# EAGLE design Schematic (EAGLE 9.4.2)
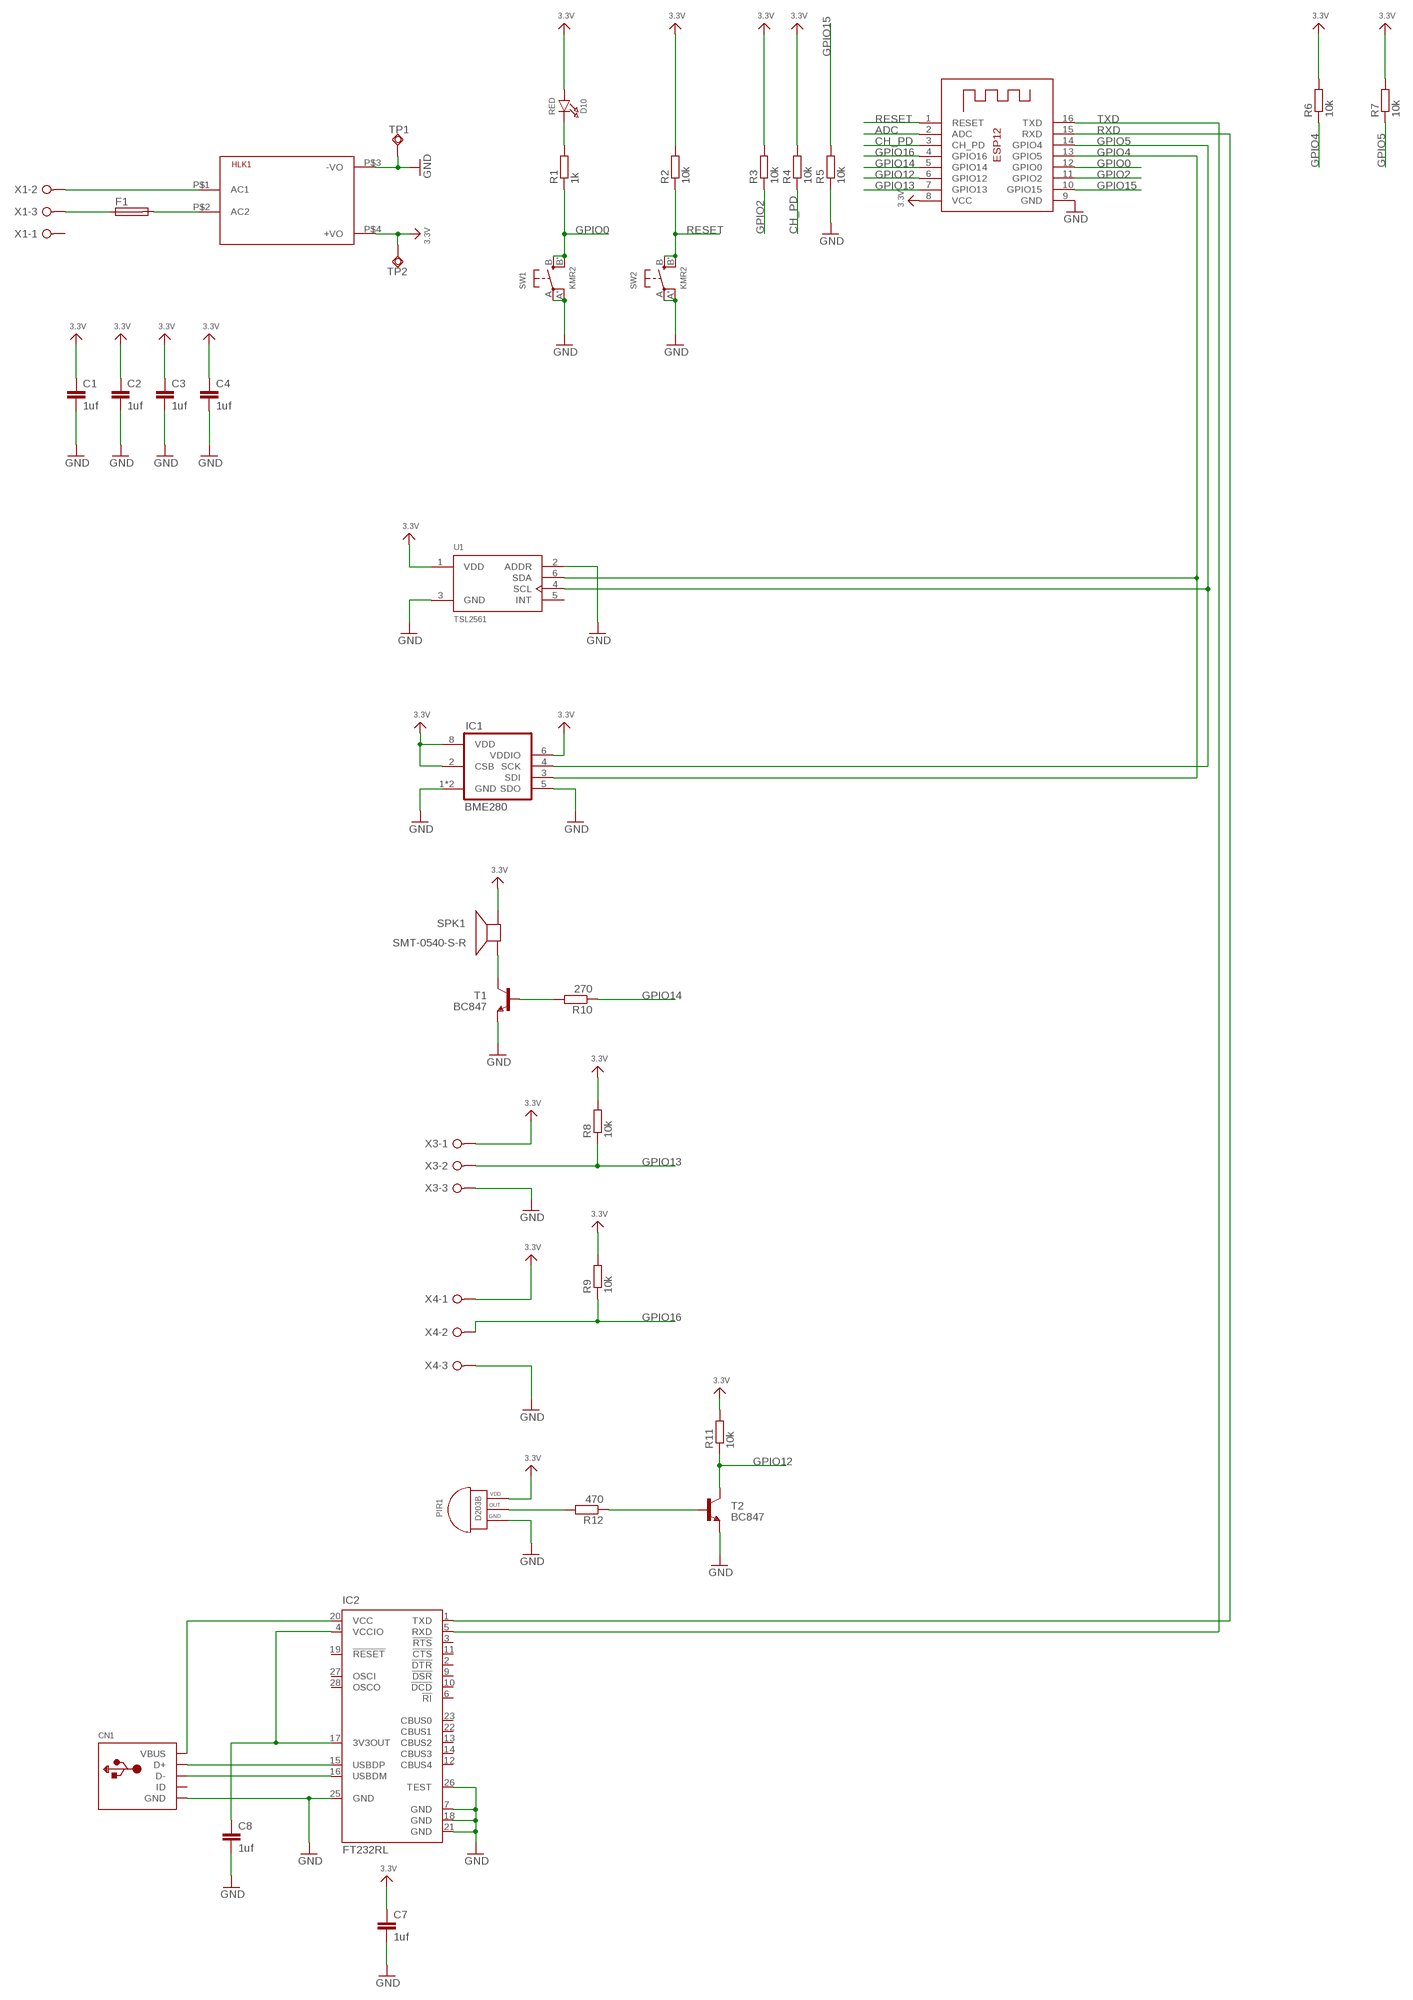
[diagram p0: schematic, sheet 1]

## Parts
C1  1uf  C-EUC0805  [C0805]
C2  1uf  C-EUC0805  [C0805]
C3  1uf  C-EUC0805  [C0805]
C4  1uf  C-EUC0805  [C0805]
C7  1uf  C-EUC0805  [C0805]
C8  1uf  C-EUC0805  [C0805]
CN1  USBMINIB  [USB-MINIB]
D10  RED  LED0805_NOOUTLINE  [CHIPLED_0805_NOOUTLINE]
F1  SH22  [SH22]
HLK1  HLK-PM013W  [HLK-PM01]
IC1  BME280  [BME280]
IC2  FT232RL  [SSOP28]
PIR1  D203B  [3PIN]
R1  1k  R-EU_M0805  [M0805]
R2  10k  R-EU_M0805  [M0805]
R3  10k  R-EU_M0805  [M0805]
R4  10k  R-EU_M0805  [M0805]
R5  10k  R-EU_M0805  [M0805]
R6  10k  R-EU_M0805  [M0805]
R7  10k  R-EU_M0805  [M0805]
R8  10k  R-EU_M0805  [M0805]
R9  10k  R-EU_M0805  [M0805]
R10  270  R-EU_M0805  [M0805]
R11  10k  R-EU_M0805  [M0805]
R12  470  R-EU_M0805  [M0805]
SPK1  SMT-0540-S-R  [SMT-0540-S-R]
SW1  KMR2  SWITCH_TACT_SMT4.6X2.8  [BTN_KMR2_4.6X2.8]
SW2  KMR2  SWITCH_TACT_SMT4.6X2.8  [BTN_KMR2_4.6X2.8]
T1  BC847  [SOT23]
T2  BC847  [SOT23]
TP1  TPSQPAD1-13Y  [P1-13Y]
TP2  TPSQPAD1-13Y  [P1-13Y]
U1  TSL2561  [TMB-6]
X1  W237-03P  [W237-133]
X2  ESP-12  [ESP-12]
X3  W237-03P  [W237-133]
X4  W237-03P  [W237-133]

## Nets
3.3V: C1.1 C2.1 C3.1 C4.1 C7.1 D10.A HLK1.P$4(+VO) IC1.2(CSB) IC1.6(VDDIO) IC1.8(VDD) PIR1.1(VDD) R2.2 R3.2 R4.2 R6.2 R7.2 R8.2 R9.2 R11.2 SPK1.+(-) TP2.TP U1.1(VDD) X2.8(VCC) X3.1 X4.1
ADC: X2.2(ADC)
CH_PD: R4.1 X2.3(CH_PD)
GND: C1.2 C2.2 C3.2 C4.2 C7.2 C8.2 CN1.GND HLK1.P$3(-VO) IC1.1(GND) IC1.5(SDO) IC1.7(GND) IC2.7(GND) IC2.18(GND) IC2.21(GND) IC2.25(GND) IC2.26(TEST) PIR1.3(GND) R5.1 SW1.A'(P1) SW1.A(P) SW2.A'(P1) SW2.A(P) T1.2(E) T2.2(E) TP1.TP U1.2(ADDR) U1.3(GND) X2.9(GND) X3.3 X4.3
GPIO0: R1.1 SW1.B'(S1) SW1.B(S) X2.12(GPIO0)
GPIO2: R3.1 X2.11(GPIO2)
GPIO4: IC1.3(SDI) R6.1 U1.6(SDA) X2.13(GPIO5)
GPIO5: IC1.4(SCK) R7.1 U1.4(SCL) X2.14(GPIO4)
GPIO12: R11.1 T2.3(C) X2.6(GPIO12)
GPIO13: R8.1 X2.7(GPIO13) X3.2
GPIO14: R10.1 X2.5(GPIO14)
GPIO15: R5.2 X2.10(GPIO15)
GPIO16: R9.1 X2.4(GPIO16) X4.2
N$1: F1.1 X1.3
N$2: F1.2 HLK1.P$2(AC2)
N$3: HLK1.P$1(AC1) X1.2
N$4: D10.C R1.2
N$5: SPK1.-(+) T1.3(C)
N$6: R10.2 T1.1(B)
N$7: PIR1.2(OUT) R12.2
N$8: R12.1 T2.1(B)
N$12: CN1.D+ IC2.15(USBDP)
N$13: CN1.D- IC2.16(USBDM)
N$32: C8.1 IC2.4(VCCIO) IC2.17(3V3OUT)
N$33: CN1.VBUS IC2.20(VCC)
RESET: R2.1 SW2.B'(S1) SW2.B(S) X2.1(RESET)
RXD: IC2.1(TXD) X2.15(RXD)
TXD: IC2.5(RXD) X2.16(TXD)
Unconnected: CN1.ID IC2.2(!DTR) IC2.3(!RTS) IC2.6(!RI) IC2.9(!DSR) IC2.10(!DCD) IC2.11(!CTS) IC2.12(CBUS4) IC2.13(CBUS2) IC2.14(CBUS3) IC2.19(!RESET) IC2.22(CBUS1) IC2.23(CBUS0) IC2.27(OSCI) IC2.28(OSCO) U1.5(INT) X1.1

## Library data of the parts
C1-C4 C7 C8 = rcl:C-EU: CAPACITOR, European symbol; SPICEPREFIX: C
CN1 = adafruit:USB: USB Connectors USBMINIB - Surface Mount Female Mini-B USB Connector 4UConnector: 06564 By microbuilder.eu Thru-hole RA Female Mini-B USB Connector 4UConnector: 18732 By ladyada.net
D10 = microbuilder:LED: LED 0603 - 0603 Surface Mount Package 2mA: Green LED - Low Power (3.9mcd, 2ma, 1.7Vf) - Digikey: 475-2709-2-ND Orange LED - Low Power (9.8mcd, 2ma, 1.8Vf) - Digikey: 475-1194-2-ND Red LED - Low Power (5mcd, 2ma, 1.8Vf) - Digikey: 475-1195-2-ND Yellow LED - Low Power (7mcd, 2ma, 1.8Vf) - Digikey: 475-1196-2-ND 5mA: Blue LED - Low Power (17mcd, 5ma, 2.9Vf) - Digikey: LNJ937W8CRACT-ND 0805 - 0805 Surface Mount Package 2mA: Red LED (8.8mcd, 2mA, 1.8Vf, Clear) - Low Power [Digikey: 475-2510-1-ND] Green LED (5mcd, 2mA, 1.8Vf, Clear) - Low Power [Digikey: 475-2730-1-ND] Yellow LED (11.3mcd, 2mA, 1.8Vf, Clear) - Low Power [Digikey: 475-2555-1-ND] 20mA: Red LED (104mcd, 20mA, Diffused) - LS R976 [Digikey: 475-1278-6-ND] Red LED (12mcd, 20mA, 2.0Vf, Clear) - APT2012EC [Digikey: 754-1128-1-ND] Green LED (15mcd, 20mA, 2.2Vf, Clear) - APT2012GC [Digikey: 754-1131-1-ND] Orange LED (160mcd, 20mA, 2.1Vf, Clear) - APT2012SECK [Digikey: 754-1130-1-ND] 1206 - 1206 Surface Mount Package Green LED (26mcd, 20mA, Diffused) - LG N971 [Digikey: 475-1407-6-ND] Red LED (15mcd, 20mA, Diffused) - LH N974 [Digikey: 475-1416-6-ND] Cree - Cree High-Power Surface Mount LEDs XPEBWT-L1-0000-00D50 - White 111lm 350mA 2.9Vf 6200K 110° XTEAWT-00-0000-00000LEE3 - White 114lm 350mA 2.85Vf 5000K 115° Everlight - Everlight 45-21 Series Surface Mount LEDs 45-21/QK2C-B2832AC2CB2/2T - Warm White 2000mcd 20mA 3.25Vf 3050K 120° 45-21/LK2C-B38452C4CB2/2T - Nuetral White 2000mcd 20mA 3.25Vf 4150K 120° 45-21/LK2C-B50634C6CB2/2T - Cold White 2200mcd 20mA 3.25Vf 5650K 120° PLCC2 Reverse Mount LS T77K-J1L2-1-0-2-R18-Z - Red 11.25mcd 2mA 1.8Vf 630nm 120° LO T77K-L1M2-24-Z - Orange 19.6mcd 2mA 1.8Vf 606nm 120° LY T77K-K2M1-26-Z - Yellow 15.7mcd 2mA 1.8Vf 587nm 120°
F1 = fuse:SH22: FUSE HOLDER CS PFP30, Schukat; OC_FARNELL: unknown; OC_NEWARK: unknown
HLK1 = HLK-PM01:HLK-PM01: Hi-Link Power Supply HLK-PM01 3W Author: Ahmed Said <https://github.com/AhmedSaid/EAGLELibraries>
IC1 = bosch-bme280:BME280: DIGITAL HUMIDITY, PRESSURE AND TEMPERATURE SENSOR * Digital interface I²C (up to 3.4 MHz) and SPI (3 and 4 wire, up to 10 MHz)* Supply voltage VDD main supply voltage range: 1.71 V to 3.6 V*VDDIO interface voltage range: 1.2 V to 3.6 V Operating range -40…+85 °C, 0…100 % rel. humidity, 300…1100 hPa The library has been designed by Richard Magdycz <https://www.facebook.com/groups/eaglecadsoftUK>
IC2 = ftdichip:FT232R: Source: http://www.ftdichip.com/Documents/DataSheets/DS_FT232R_v104.pdf; MPN: FT232RL; OC_FARNELL: 1146032; OC_NEWARK: 91K9918
PIR1 = senba-pir-sensor:D203B
R1-R12 = resistor:R-EU_: RESISTOR, European symbol
SPK1 = adafruit:SMT-0540-S-R: SMT-0549-S-R Small surface-mount magnetic buzzer
SW1 SW2 = microbuilder:SWITCH_TACT_SMT: SMT Tact Switches 6x6mm - Digikey: P12940SCT-ND KMR2 (4.6x2.8mm) - Digikey: 401-1426-1-ND EVQ-PQHB55 - Light Touch, 160GF (4.5x4.5mm) - Digikey: P8090SCT-ND KMT0 - KMT021 NGJ LHS (etc.) IP68/Waterproof - Digikey: CKN10289CT-ND
T1 T2 = transistor:BC847: NPN TRANSISTOR
TP1 TP2 = testpad:TPSQ: Test pad
U1 = eagle-library-edeca.net-v5:TSL256*: Texas Instruments TSL2560 (SMBus), TSL2561 (I2C) Light-to-digital converter; INTERFACE: I2C
X1 X3 X4 = con-wago-508:W237-03P: WAGO SREW CLAMP; OC_FARNELL: unknown; OC_NEWARK: unknown
X2 = microbuilder:ESP-12

## Board
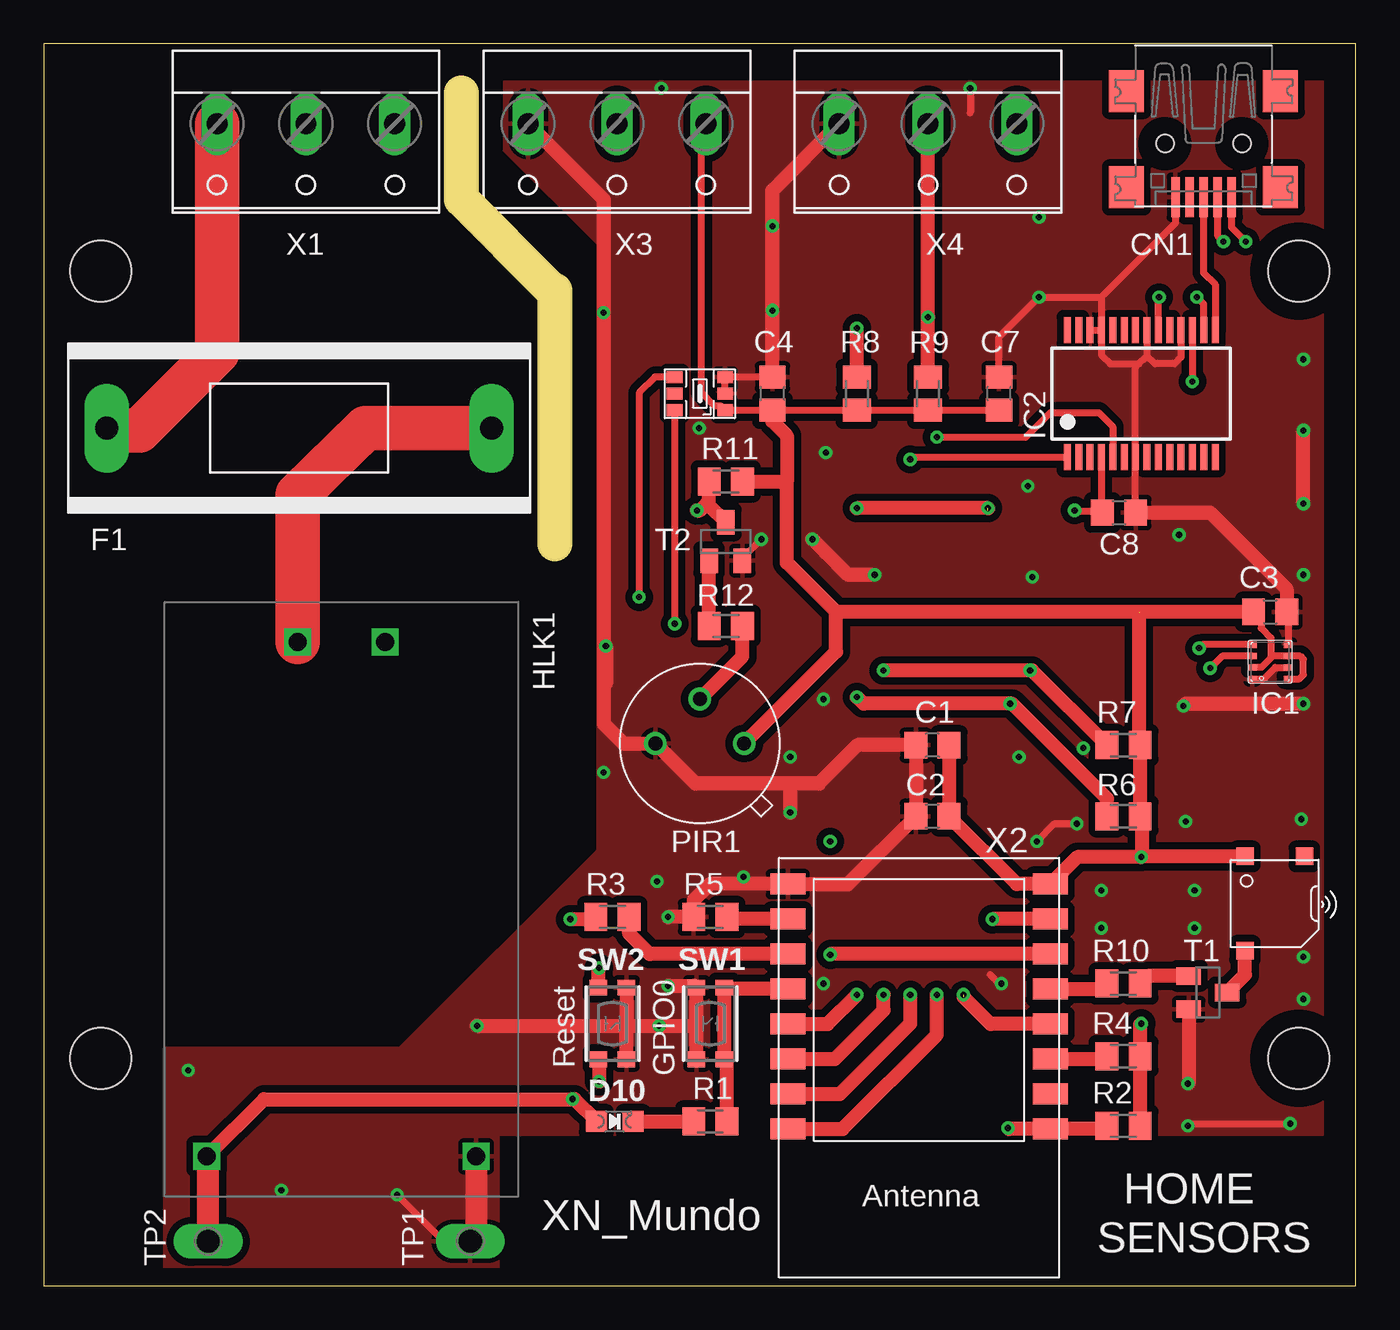
[diagram p1: board, top side]
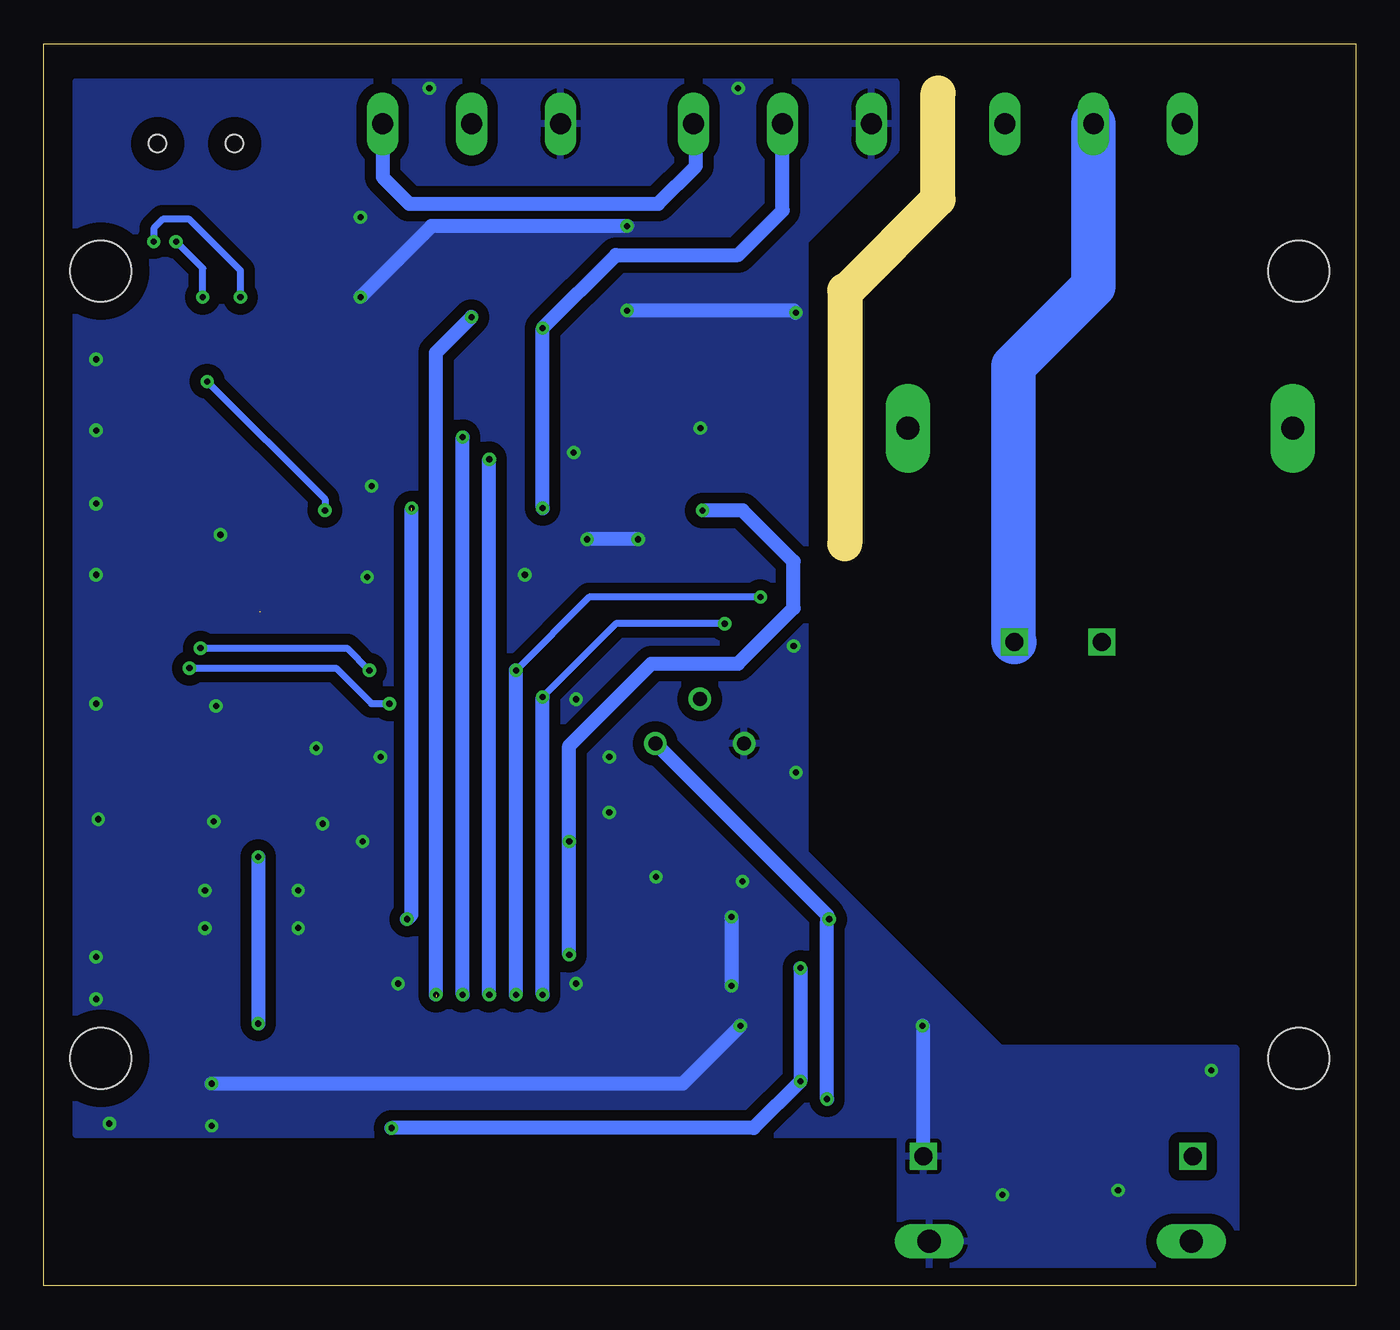
[diagram p2: board, bottom side, seen from below]

Size 75 x 71 mm. Coordinates in mm from the lower left corner, seen from the top.
Outline: 0,0 75,0 75,71 0,71 0,0
Copper layers (1*16): Top 0.035mm / dielectric 1.5mm / Bottom 0.035mm
Design rules "default": minimum track width 6mil, minimum drill 0.35mm, track to track 6mil, track to pad 6mil, pad to pad 6mil, via to via 6mil, smd to smd 6mil, copper to edge 40mil, drill to drill 6mil, minimum pad ring 10mil, minimum via ring 8mil, stop-mask expansion 4mil, vias tented up to drill 0mil, thermal gap 10mil
Holes 3.5 mm at 3.25,13 71.75,13 71.75,58 3.25,58
Milling: 3 lines

### Footprints (pad centres in the part's own frame; a part is rotated, then mirrored left to right if it is on the bottom)
C0805 = smd 1.3 x 1.5: 1 -0.95,0; 2 0.95,0
USB-MINIB = smd 0.5 x 2.308: D+ 0,4.064; D- -0.8,4.064; GND 1.6,4.064; ID 0.8,4.064; VBUS -1.6,4.064 | smd 2 x 2.4: GND1 -4.4,-2; GND2 -4.4,3.5; GND3 4.4,3.5; GND4 4.4,-2 | hole 1: -2.2,1; 2.2,1
CHIPLED_0805_NOOUTLINE = smd 1.2 x 1.2: A 0,-1.05; C 0,1.05
SH22 = drill 1.321 pad 2.54 long: 1 -10.998,0; 2 10.998,0
HLK-PM01 = drill 1.016 square: P$1 -14.7,2.5; P$2 -14.7,-2.5; P$3 14.7,7.7; P$4 14.7,-7.7
BME280 = smd 0.35 x 0.5: 1 0.975,-1.025; 2 0.325,-1.025; 3 -0.325,-1.025; 4 -0.975,-1.025; 5 -0.975,1.025; 6 -0.325,1.025; 7 0.325,1.025; 8 0.975,1.025
SSOP28 = smd 0.4 x 1.5: 1 -4.225,-3.625; 2 -3.575,-3.625; 3 -2.925,-3.625; 4 -2.275,-3.625; 5 -1.625,-3.625; 6 -0.975,-3.625; 7 -0.325,-3.625; 8 0.325,-3.625; 9 0.975,-3.625; 10 1.625,-3.625; 11 2.275,-3.625; 12 2.925,-3.625; 13 3.575,-3.625; 14 4.225,-3.625; 15 4.225,3.625; 16 3.575,3.625; 17 2.925,3.625; 18 2.275,3.625; 19 1.625,3.625; 20 0.975,3.625; 21 0.325,3.625; 22 -0.325,3.625; 23 -0.975,3.625; 24 -1.625,3.625; 25 -2.275,3.625; 26 -2.925,3.625; 27 -3.575,3.625; 28 -4.225,3.625
3PIN = drill 0.8: 1 2.54,0; 2 0,2.54; 3 -2.54,0
M0805 = smd 1.3 x 1.6: 1 -0.95,0; 2 0.95,0
SMT-0540-S-R = smd 1 x 1: + 1.7,-2.7; - 1.7,2.7; M -1.7,-2.7
BTN_KMR2_4.6X2.8 = smd 0.9 x 1: A 2.05,0.8; A' -2.05,0.8; B 2.05,-0.8; B' -2.05,-0.8
SOT23 = smd 1 x 1.4: 1 -0.95,-1.1; 2 0.95,-1.1; 3 0,1.1
P1-13Y = drill 1.321 pad 1.905 long: TP 0,0
TMB-6 = smd 0.9 x 0.7: 1 -1.45,0.95; 2 -1.45,0; 3 -1.45,-0.95; 4 1.45,-0.95; 5 1.45,0; 6 1.45,0.95
W237-133 = drill 1.194 long: 1 -5.08,-0.635; 2 0,-0.635; 3 5.08,-0.635
ESP-12 = smd 2 x 1.2: 1 -7.5,4.5; 2 -7.5,2.5; 3 -7.5,0.5; 4 -7.5,-1.5; 5 -7.5,-3.5; 6 -7.5,-5.5; 7 -7.5,-7.5; 8 -7.5,-9.5; 9 7.5,-9.5; 10 7.5,-7.5; 11 7.5,-5.5; 12 7.5,-3.5; 13 7.5,-1.5; 14 7.5,0.5; 15 7.5,2.5; 16 7.5,4.5

### Placement (x,y rotation side)
C1  50.8,30.9 180 top
C2  50.8,26.84 180 top
C3  70.1,38.52 0 top
C4  41.66,51 90 top
C7  54.61,51 90 top
C8  61.47,44.2 0 top
CN1  66.29,66.29 180 top
D10  32.64,9.4 270 top
F1  14.61,49.02 0 top
HLK1  17.02,22.1 270 top
IC1  70.1,35.67 270 top
IC2  62.74,51 0 top
PIR1  37.5,31 0 top
R1  38.1,9.4 180 top
R2  61.72,9.14 0 top
R3  32.51,21.08 180 top
R4  61.72,13.12 0 top
R5  38.1,21.08 0 top
R6  61.72,26.84 0 top
R7  61.72,30.9 0 top
R8  46.48,51 270 top
R9  50.55,51 270 top
R10  61.72,17.27 0 top
R11  38.99,45.97 0 top
R12  38.99,37.72 0 top
SPK1  70.36,21.84 180 top
SW1  38.1,14.99 90 top
SW2  32.51,14.99 270 top
T1  66.55,16.76 270 top
T2  38.99,42.55 0 top
TP1  24.38,2.54 90 top
TP2  9.4,2.54 90 top
U1  37.5,51 180 top
X1  14.99,65.79 180 top
X2  50.04,13.46 180 top
X3  32.77,65.79 180 top
X4  50.55,65.79 180 top

### Tracks (layer width: path | path; a pad name or v marks a point on that pad's centre or on a via)
3.3V  (via drill 0.35)  (1 unrouted)
  Top 0.406: C7.1 R9.2 R8.2 C4.1 U1.1 38.71,50.29 38.35,50.29 37.59,51.05 37.59,66.17 X3.1 | IC1.2 69.61,35.35 70.15,35.89 | 70.15,35.89 70.26,36 IC1.6 71.83,36 72.01,35.81 72.01,34.92 71.78,34.7 IC1.8 | C3.1 69.6,38.08 69.6,37.59 70.15,37.03 70.15,35.89
  Top 0.813: HLK1.P$4 12.59,10.67 v30.23,10.67 30.35,10.67 31.59,9.43 D10.A | R3.2 31.43,20.95 v30.1,20.95 | C1.1 C2.1 55.63,22.96 X2.8 59.09,24.51 v62.74,24.51 62.77,24.54 | R2.2 R4.2 62.67,14.92 v62.74,14.99 | SPK1.+ 62.77,24.54 | 62.77,24.54 62.77,26.74 R6.2 R7.2 62.61,30.96 62.61,38.52 45.3,38.52 | C3.1 62.65,38.52 | 45.28,38.54 42.48,41.34 42.48,45.97 | C4.1 41.66,49.41 42.48,48.59 42.48,45.97 | 45.28,38.54 45.25,38.52 | 40.17,31.28 40.17,31.13 PIR1.1 45.3,36.26 45.3,38.52 | R11.2 42.48,45.97 | 45.3,38.52 45.28,38.54
  Top 1.27: TP2.TP 9.4,7.32 HLK1.P$4
  Bottom 0.813: v30.23,10.67 30.23,20.83 | 30.23,20.83 v30.1,20.95 | PIR1.1 30.23,21.19 30.23,20.83 | v62.74,24.51 v62.74,14.99 | X4.1 55.63,63.37 54.1,61.85 39.88,61.85 37.72,64.01 37.72,66.29 X3.1
CH_PD
  Top 0.813: X2.3 60.61,12.96 R4.1
GND  (via drill 0.35)
  Top 0.406: U1.2 U1.3 C4.2 | C8.2 IC2.7 62.41,52.51 62.61,52.7 | IC2.26 IC2.25 | IC2.25 60.46,53.2 60.96,52.7 62.61,52.7 | 62.61,52.7 63.06,53.16 | IC2.21 63.06,53.16 | IC2.18 65.01,53.08 64.64,52.7 63.52,52.7 63.06,53.16 | CN1.GND 64.69,60.76 60.46,56.53 | 60.46,56.53 IC2.25 | C7.2 54.61,54.23 v56.9,56.52 v56.91,56.53 60.46,56.53 | IC1.1 69.75,34.7 70.4,35.35 IC1.7 | C3.2 71.13,38.45 IC1.5 | v65.41,9.14 65.53,9.27 v71.25,9.27 | v56.77,25.4 57.78,26.42 v59.05,26.42 | v54.74,17.27 54.61,17.27 54.1,17.78 | v20.19,5.21 22.53,2.87 24.72,2.87 | v52.96,68.45 52.96,67.06 | T2.2 39.94,41.59 v41.02,42.67
  Top 0.813: v24.77,14.86 33.53,14.86 | 33.53,14.86 v35.18,14.86 37.08,14.86 | 37.08,14.86 37.3,15.07 SW1.A 37.19,17.14 v35.69,17.14 | SW1.A' 37.3,14.64 37.08,14.86 | SW2.A 33.31,14.64 33.53,14.86 | SW2.A' 33.31,15.07 33.53,14.86 | v35.69,21.08 R5.1 37.15,22.04 38.08,22.96 X2.9 45.97,22.96 C2.2 C1.2 46.52,30.9 44.32,28.7 42.93,28.7 | 42.93,28.7 37.26,28.7 PIR1.3 33.13,31 32,32.13 32,34.29 | C4.2 v41.66,55.75 v41.66,60.58 41.66,62.61 X4.3 | X3.3 32,62.1 v32,55.63 32,34.29 | C8.2 66.67,44.2 71.05,39.82 C3.2 | T1.2 65.45,11.6 v65.41,11.56 | v32.13,36.58 32.13,34.42 32,34.29 | v42.67,27.05 42.67,28.45 42.93,28.7 | v72.01,44.7 v72.01,48.9 | v47.5,40.64 45.97,40.64 44.7,41.91 v43.94,42.67 | v65.15,33.15 65.28,33.27 v72.01,33.27
  Top 1.27: HLK1.P$3 24.72,2.87 TP1.TP
  Bottom 0.813: v24.77,14.86 24.72,14.81 HLK1.P$3 | v35.69,21.08 v35.69,17.14 | v32,55.63 32.13,55.75 v41.66,55.75 | v41.66,60.58 52.83,60.58 v56.9,56.52 | v35.18,14.86 38.48,11.56 v65.41,11.56 | v41.02,42.67 v43.94,42.67
  other vias: 32,29.34 40.01,23.37 35.05,23.11 42.67,30.23 72.01,52.96 37.47,49.02 44.7,47.62 56.26,45.72 56.52,40.51 64.9,42.93 72.01,40.64 71.88,26.67 65.28,26.54 60.45,22.61 60.45,20.45 65.79,20.45 65.79,22.61 72.01,18.8 72.01,16.38 56.9,61.09 59.44,30.73 44.58,33.53 55.75,30.23 44.58,17.27 13.59,5.46 8.26,12.32 35.31,68.45
  pour Bottom (isolate 0.61): 26.04,8.64 73.15,8.64 73.15,68.83 26.29,68.83 26.29,64.9 31.5,59.69 31.5,24.77 20.32,13.59 6.86,13.59 6.86,0.76 26.04,0.76
  pour Top (isolate 0.406): 26.04,8.64 73.15,8.64 73.15,68.83 26.29,68.83 26.29,64.9 31.62,59.56 31.62,24.89 20.32,13.59 6.86,13.59 6.86,1.02 26.04,1.02
GPIO0
  Top 0.813: X2.12 38.97,16.96 | 38.97,16.96 SW1.B | 38.97,16.96 38.9,16.89 SW1.B' 39.05,12.79 R1.1
GPIO2
  Top 0.813: X2.11 34.63,18.96 33.46,20.13 R3.1
GPIO4  (via drill 0.35)
  Top 0.406: U1.6 36.07,50.03 v36.07,37.85 36.07,37.72 | IC1.3 67.36,36 v66.67,35.31
  Top 0.813: X2.13 44.81,14.96 v46.48,16.64 | R6.1 60.77,27.86 55.35,33.27 v55.24,33.27 46.86,33.27 v46.48,33.66
  Bottom 0.406: v36.07,37.85 42.29,37.85 v46.48,33.66 | v66.67,35.31 58.29,35.31 56.26,33.27 v55.24,33.27
  Bottom 0.813: v46.48,16.64 v46.48,33.66
GPIO5  (via drill 0.35)
  Top 0.406: U1.4 34.93,51.95 34.04,51.05 v34.04,39.37 | IC1.4 66.24,36.65 v66.04,36.45
  Top 0.813: X2.14 45.22,12.96 48.01,15.75 v48.01,16.64 | R7.1 56.5,35.18 v56.39,35.18 v48.01,35.18
  Bottom 0.406: v34.04,39.37 43.81,39.37 v48.01,35.18 | v66.04,36.45 57.66,36.45 v56.39,35.18
  Bottom 0.813: v48.01,16.64 v48.01,35.18
GPIO12  (via drill 0.35)
  Top 0.813: X2.6 45,18.96 v44.96,18.92 | T2.3 38.04,44.59 | 38.04,44.59 37.91,44.72 37.51,44.32 v37.34,44.32 | 38.04,44.59 R11.1
  Bottom 0.813: v44.96,18.92 v44.96,25.4 44.96,30.86 40.26,35.56 35.31,35.56 32.13,38.73 32.13,41.4 35.05,44.32 v37.34,44.32
GPIO13  (via drill 0.35)  (1 unrouted)
  Top 0.813: R8.1 v46.48,54.74 | X2.7 54.24,20.96 v54.23,20.95 | v53.98,44.45 v46.48,44.45
  Bottom 0.813: X3.2 32.77,61.47 35.31,58.93 42.29,58.93 v46.48,54.74 v46.48,44.45 | v54.23,20.95 53.98,21.21 53.98,44.32
GPIO14
  Top 0.813: X2.5 60.46,16.96 R10.1
GPIO15
  Top 0.813: X2.10 39.17,20.96 R5.2
GPIO16  (via drill 0.35)  (1 unrouted)
  Top 0.813: X4.2 v50.55,55.37 R9.1 | X2.4 54.13,14.96 52.58,16.51
  Bottom 0.813: v52.58,16.64 52.58,53.34 v50.55,55.37
N$1
  Top 2.54: X1.3 9.91,53.34 5.46,48.9 3.73,48.9 F1.1
N$2
  Top 2.54: F1.2 18.41,49.02 14.52,45.24 HLK1.P$2
N$3
  Bottom 2.54: X1.2 14.99,57.15 19.56,52.58 19.56,36.84 HLK1.P$1
N$4
  Top 0.813: D10.C R1.2
N$5
  Top 0.813: T1.3 68.66,17.77 SPK1.-
N$6
  Top 0.813: T1.1 63.11,17.71 R10.2
N$7
  Top 0.813: PIR1.2 39.94,35.98 R12.2
N$8
  Top 0.813: R12.1 T2.1
N$12
  Top 0.406: CN1.D+ 66.29,57.91 66.96,57.24 IC2.15
N$13  (via drill 0.35)
  Top 0.406: CN1.D- 67.09,60.03 v67.44,59.69 | IC2.16 66.31,56.12 v65.91,56.52
  Bottom 0.406: v65.91,56.52 65.91,58.17 v67.44,59.69
N$32  (via drill 0.35)
  Top 0.406: IC2.4 60.46,44.25 | 60.46,44.25 C8.1 | IC2.17 v65.66,51.69 | 60.46,44.25 59,44.25 v58.93,44.32
  Bottom 0.406: v65.66,51.69 58.93,44.96 v58.93,44.32
N$33  (via drill 0.35)
  Top 0.406: CN1.VBUS 67.89,60.5 v68.71,59.69 | IC2.20 63.71,56.47 v63.75,56.52
  Bottom 0.406: v63.75,56.52 63.75,58.04 66.67,60.96 68.2,60.96 68.71,60.45 v68.71,59.69
RESET  (via drill 0.35)
  Top 0.813: R2.1 60.59,8.96 X2.1 55.17,8.96 v55.12,9.02 | SW2.B' 31.71,18.12 v31.75,18.16 | SW2.B 31.75,12.9 v31.75,11.68
  Bottom 0.813: v31.75,18.16 v31.75,11.68 34.42,9.02 v55.12,9.02
RXD  (via drill 0.35)
  Top 0.406: v49.53,47.24 49.66,47.38 IC2.1
  Top 0.813: X2.15 45.51,10.96 49.53,14.99 v49.53,16.64
  Bottom 0.813: v49.53,16.64 v49.53,47.24
TXD  (via drill 0.35)
  Top 0.406: v51.05,48.51 56.13,48.51 57.53,49.91 60.33,49.91 61.11,49.12 IC2.5
  Top 0.813: X2.16 45.66,8.96 51.05,14.35 v51.05,16.64
  Bottom 0.813: v51.05,16.64 v51.05,48.51

### Text on the board
tNames: GPIO0 | Reset | HOME | XN_Mundo | SENSORS